# EAGLE design Signal (EAGLE 9.5.2)
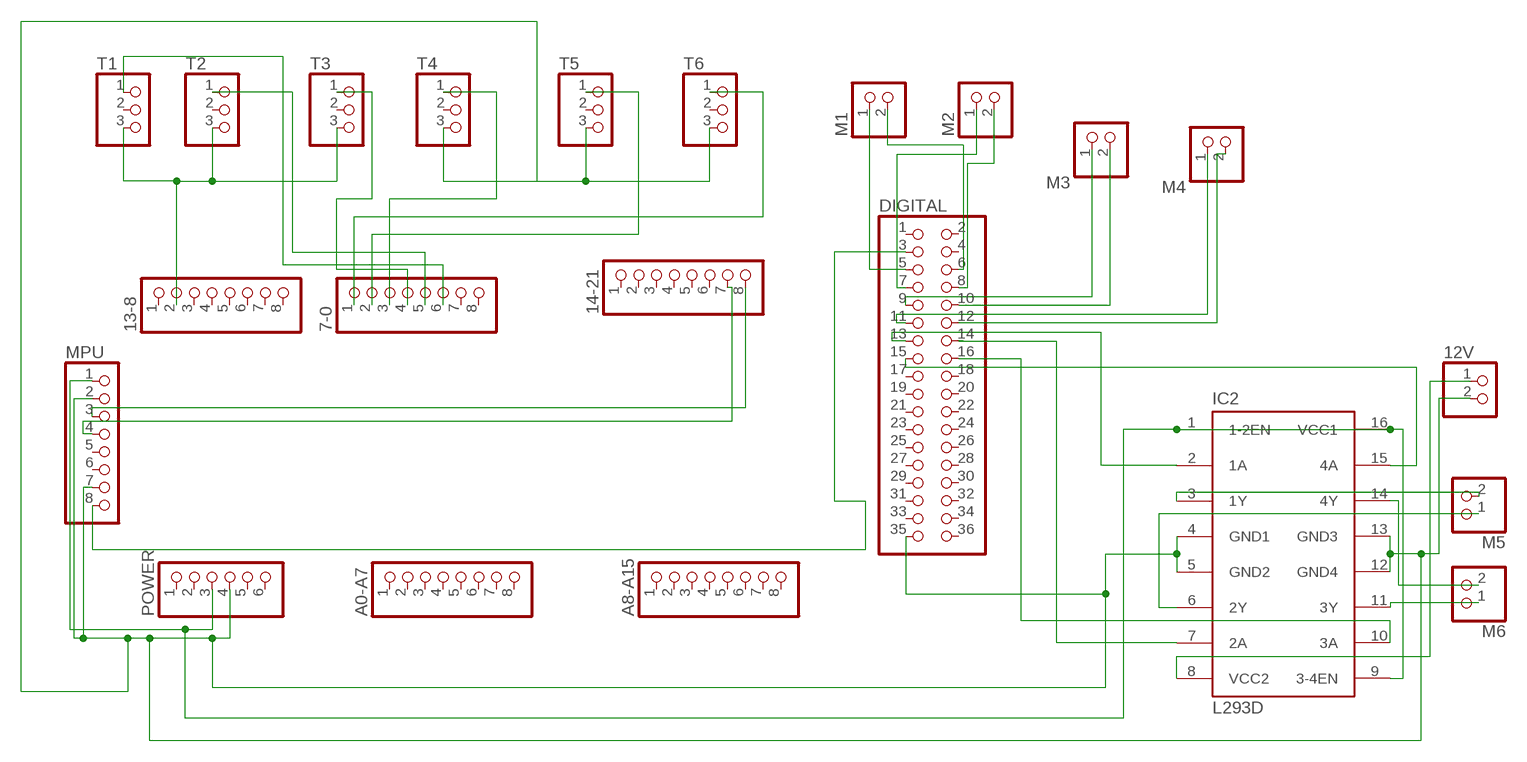
[diagram p0: schematic, sheet 1]

## Parts
7-0  PINHD-1X8  [1X08]
12V  PINHD-1X2  [1X02]
13-8  PINHD-1X8  [1X08]
14-21  PINHD-1X8  [1X08]
A0-A7  PINHD-1X8  [1X08]
A8-A15  PINHD-1X8  [1X08]
DIGITAL  PINHD-2X18  [2X18]
IC2  L293D  [DIL16]
M1  PINHD-1X2  [1X02]
M2  PINHD-1X2  [1X02]
M3  PINHD-1X2  [1X02]
M4  PINHD-1X2  [1X02]
M5  PINHD-1X2  [1X02]
M6  PINHD-1X2  [1X02]
MPU  PINHD-1X8  [1X08]
POWER  PINHD-1X6  [1X06]
T1  PINHD-1X3  [1X03]
T2  PINHD-1X3  [1X03]
T3  PINHD-1X3  [1X03]
T4  PINHD-1X3  [1X03]
T5  PINHD-1X3  [1X03]
T6  PINHD-1X3  [1X03]

## Nets
N$1: DIGITAL.9 M3.1
N$2: DIGITAL.10 M3.2
N$3: DIGITAL.8 M2.2
N$4: 7-0.1 T6.1
N$5: 7-0.2 T5.1
N$6: 7-0.3 T4.1
N$7: 7-0.4 T3.1
N$8: 7-0.5 T2.1
N$10: DIGITAL.5 M1.1
N$11: DIGITAL.6 M1.2
N$12: DIGITAL.7 M2.1
N$13: DIGITAL.11 M4.1
N$14: DIGITAL.12 M4.2
N$15: 12V.2 DIGITAL.35 IC2.4(GND1) IC2.5(GND2) IC2.12(GND4) IC2.13(GND3) MPU.2 MPU.7 POWER.4 T4.3 T5.3 T6.3
N$16: DIGITAL.13 IC2.2(1A)
N$17: DIGITAL.14 IC2.7(2A)
N$18: DIGITAL.15 IC2.15(4A)
N$19: DIGITAL.16 IC2.10(3A)
N$20: IC2.1(1-2EN) IC2.9(3-4EN) IC2.16(VCC1) MPU.1 POWER.3
N$21: DIGITAL.3 MPU.8
N$22: 7-0.6 T1.1
N$23: 14-21.8 MPU.3
N$24: 14-21.7 MPU.4
N$25: 13-8.2 T1.3 T2.3 T3.3
N$31: IC2.6(2Y) M5.1
N$32: 12V.1 IC2.8(VCC2)
N$34: IC2.14(4Y) M6.2
N$35: IC2.3(1Y) M5.2
N$36: IC2.11(3Y) M6.1
Unconnected: 7-0.7 7-0.8 13-8.1 13-8.3 13-8.4 13-8.5 13-8.6 13-8.7 13-8.8 14-21.1 14-21.2 14-21.3 14-21.4 14-21.5 14-21.6 A0-A7.1 A0-A7.2 A0-A7.3 A0-A7.4 A0-A7.5 A0-A7.6 A0-A7.7 A0-A7.8 A8-A15.1 A8-A15.2 A8-A15.3 A8-A15.4 A8-A15.5 A8-A15.6 A8-A15.7 A8-A15.8 DIGITAL.1 DIGITAL.2 DIGITAL.4 DIGITAL.17 DIGITAL.18 DIGITAL.19 DIGITAL.20 DIGITAL.21 DIGITAL.22 DIGITAL.23 DIGITAL.24 DIGITAL.25 DIGITAL.26 DIGITAL.27 DIGITAL.28 DIGITAL.29 DIGITAL.30 DIGITAL.31 DIGITAL.32 DIGITAL.33 DIGITAL.34 DIGITAL.36 MPU.5 MPU.6 POWER.1 POWER.2 POWER.5 POWER.6 T1.2 T2.2 T3.2 T4.2 T5.2 T6.2

## Library data of the parts
7-0 13-8 14-21 A0-A7 A8-A15 MPU = pinhead:PINHD-1X8: PIN HEADER
12V M1-M6 = pinhead:PINHD-1X2: PIN HEADER
DIGITAL = pinhead:PINHD-2X18: PIN HEADER
IC2 = st-microelectronics:L293D: PUSH-PULL 4 CHANNEL DRIVER; MPN: L293D; OC_FARNELL: 9589619; OC_NEWARK: 56P8249
POWER = pinhead:PINHD-1X6: PIN HEADER
T1-T6 = pinhead:PINHD-1X3: PIN HEADER

## Board
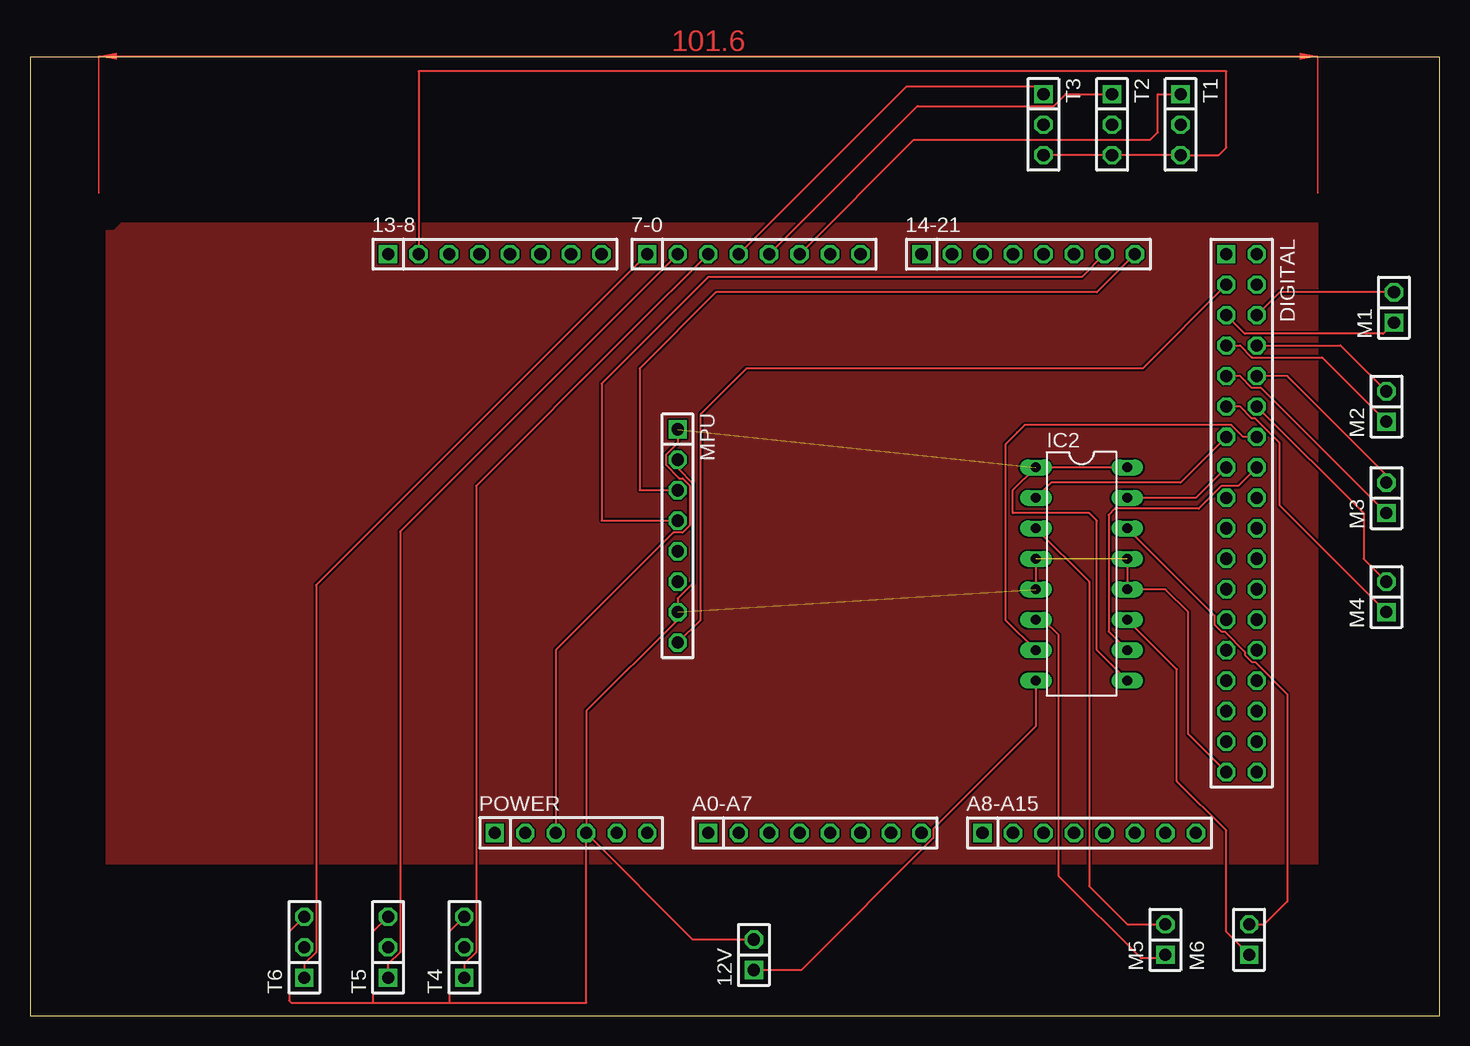
[diagram p1: board, top side]

Size 117.48 x 79.93 mm. Coordinates in mm from the lower left corner, seen from the top.
Outline: 0,0 117.48,0 117.48,79.93 0,79.93 0,0
Copper layers (1*16): Top 0.035mm / dielectric 1.5mm / Bottom 0.035mm
Design rules "default": minimum track width 6mil, minimum drill 0.35mm, track to track 6mil, track to pad 6mil, pad to pad 6mil, via to via 6mil, smd to smd 6mil, copper to edge 40mil, drill to drill 6mil, minimum pad ring 10mil, minimum via ring 8mil, stop-mask expansion 4mil, vias tented up to drill 0mil, thermal gap 10mil

### Footprints (pad centres in the part's own frame; a part is rotated, then mirrored left to right if it is on the bottom)
1X08 = drill 1.016 square: 1 -8.89,0 | drill 1.016 octagon: 2 -6.35,0; 3 -3.81,0; 4 -1.27,0; 5 1.27,0; 6 3.81,0; 7 6.35,0; 8 8.89,0
1X02 = drill 1.016 square: 1 -1.27,0 | drill 1.016 octagon: 2 1.27,0
2X18 = drill 1.016 square: 1 -21.59,-1.27 | drill 1.016 octagon: 2 -21.59,1.27; 3 -19.05,-1.27; 4 -19.05,1.27; 5 -16.51,-1.27; 6 -16.51,1.27; 7 -13.97,-1.27; 8 -13.97,1.27; 9 -11.43,-1.27; 10 -11.43,1.27; 11 -8.89,-1.27; 12 -8.89,1.27; 13 -6.35,-1.27; 14 -6.35,1.27; 15 -3.81,-1.27; 16 -3.81,1.27; 17 -1.27,-1.27; 18 -1.27,1.27; 19 1.27,-1.27; 20 1.27,1.27; 21 3.81,-1.27; 22 3.81,1.27; 23 6.35,-1.27; 24 6.35,1.27; 25 8.89,-1.27; 26 8.89,1.27; 27 11.43,-1.27; 28 11.43,1.27; 29 13.97,-1.27; 30 13.97,1.27; 31 16.51,-1.27; 32 16.51,1.27; 33 19.05,-1.27; 34 19.05,1.27; 35 21.59,-1.27; 36 21.59,1.27
DIL16 = drill 0.813 long: 1 -8.89,-3.81; 2 -6.35,-3.81; 3 -3.81,-3.81; 4 -1.27,-3.81; 5 1.27,-3.81; 6 3.81,-3.81; 7 6.35,-3.81; 8 8.89,-3.81; 9 8.89,3.81; 10 6.35,3.81; 11 3.81,3.81; 12 1.27,3.81; 13 -1.27,3.81; 14 -3.81,3.81; 15 -6.35,3.81; 16 -8.89,3.81
1X06 = drill 1.016 square: 1 -6.35,0 | drill 1.016 octagon: 2 -3.81,0; 3 -1.27,0; 4 1.27,0; 5 3.81,0; 6 6.35,0
1X03 = drill 1.016 square: 1 -2.54,0 | drill 1.016 octagon: 2 0,0; 3 2.54,0

### Placement (x,y rotation side)
7-0  60.33,63.5 0 top
12V  60.33,5.08 90 top
13-8  38.73,63.5 0 top
14-21  83.19,63.5 0 top
A0-A7  65.41,15.24 0 top
A8-A15  88.27,15.24 0 top
DIGITAL  100.97,41.91 270 top
IC2  87.63,36.83 270 top
M1  113.67,59.05 90 top
M2  113.03,50.8 90 top
M3  113.03,43.18 90 top
M4  113.03,34.92 90 top
M5  94.62,6.35 90 top
M6  101.6,6.35 90 top
MPU  53.97,40 270 top
POWER  45.08,15.24 0 top
T1  95.89,74.3 270 top
T2  90.17,74.3 270 top
T3  84.45,74.3 270 top
T4  36.2,5.71 90 top
T5  29.84,5.71 90 top
T6  22.86,5.71 90 top

### Tracks (layer width: path | path; a pad name or v marks a point on that pad's centre or on a via)
N$1
  Top 0.152: M3.1 102.59,52.35 101.83,52.35 100.83,53.34 DIGITAL.9
N$2
  Top 0.152: DIGITAL.10 104.78,53.34 113.03,45.08 M3.2
N$3
  Top 0.152: DIGITAL.8 109.22,55.88 M2.2
N$4
  Top 0.152: T6.1 22.86,4.31 23.85,5.3 23.85,35.92 7-0.1
N$5
  Top 0.152: 7-0.2 30.84,40.36 30.84,5.3 29.84,4.31 T5.1
N$6
  Top 0.152: T4.1 36.2,4.31 37.19,5.3 37.19,44.17 50.17,57.15 7-0.3
N$7
  Top 0.152: 7-0.4 73.03,77.47 83.82,77.47 T3.1
N$8
  Top 0.152: T2.1 86.3,76.84 85.31,75.84 73.94,75.84 7-0.5
N$9
  pour Top: 6.35,65.41 6.35,44.45 6.35,25.4 6.35,12.7 61.59,12.7 107.31,12.7 107.31,66.04 43.18,66.04 8.25,66.04 7.62,66.04 6.98,65.41
N$10
  Top 0.152: M1.1 112.75,56.87 101.24,56.87 DIGITAL.5
N$11
  Top 0.152: M1.2 104.14,60.33 DIGITAL.6
N$12
  Top 0.152: DIGITAL.7 100.83,55.88 101.83,54.89 107.67,54.89 M2.1
N$13
  Top 0.152: M4.1 104.14,42.55 104.14,47.76 102.09,49.81 101.83,49.81 100.83,50.8 DIGITAL.11
N$14
  Top 0.152: DIGITAL.12 111.12,41.91 111.12,38.1 M4.2
N$15  (2 unrouted)
  Top 0.152: IC2.13 IC2.12 94.62,35.56 96.52,33.66 96.52,23.49 DIGITAL.35 | T4.3 34.92,6.98 34.92,1.09 | 34.92,1.09 46.36,1.09 POWER.4 | POWER.4 55.25,6.35 12V.2 | T6.3 21.59,6.98 21.59,1.27 21.77,1.09 28.57,1.09 | 28.57,1.09 34.92,1.09 | T5.3 28.57,6.98 28.57,1.09 | MPU.2 53.97,45.65 55.27,44.35 55.27,36.09 53.97,34.79 MPU.7 53.97,33.02 46.36,25.4 POWER.4 | IC2.4 IC2.5
N$16
  Top 0.152: DIGITAL.13 95.89,44.45 85.09,44.45 IC2.2
N$17
  Top 0.152: DIGITAL.14 101.1,48.26 100.11,49.25 82.89,49.25 82.27,48.63 82.27,48.62 81.28,47.62 81.28,33.02 IC2.7
N$18
  Top 0.152: DIGITAL.15 97.16,43.18 IC2.15
N$19
  Top 0.152: DIGITAL.16 100.69,44.17 99.28,44.17 97.41,42.29 90.41,42.29 89.89,41.77 89.89,32.03 IC2.10
N$20  (1 unrouted)
  Top 0.152: MPU.1 53.97,47.76 52.98,46.77 52.98,45.94 54.12,44.81 54.39,44.81 54.97,44.22 54.97,40.86 54.39,40.28 53.62,40.28 43.81,30.48 POWER.3 | IC2.16 IC2.1 81.92,43.81 81.92,41.91 88.27,41.91 88.9,41.27 88.9,30.48 IC2.9
N$21
  Top 0.152: DIGITAL.3 92.71,53.97 59.69,53.97 55.88,50.17 55.88,33.02 MPU.8
N$22
  Top 0.152: 7-0.6 73.66,73.03 93.34,73.03 93.98,73.66 93.98,76.84 T1.1
N$23
  Top 0.152: 14-21.8 88.9,60.33 57.15,60.33 50.8,53.97 50.8,43.81 MPU.3
N$24
  Top 0.152: 14-21.7 87.63,61.59 56.52,61.59 47.62,52.7 47.62,41.27 MPU.4
N$25
  Top 0.152: T3.3 T2.3 T1.3 99.06,71.75 99.7,72.39 99.7,78.74 32.39,78.74 13-8.2
N$31
  Top 0.152: M5.1 94.31,4.77 92.58,4.77 85.73,11.63 85.73,31.75 84.45,33.02 IC2.6
N$32
  Top 0.152: IC2.8 83.82,24.13 75.29,15.6 75.29,14.83 64.27,3.81 12V.1
N$34
  Top 0.152: M6.2 102.87,7.62 104.78,9.52 104.78,21.59 104.78,21.72 104.78,26.8 102.09,29.49 101.83,29.49 101.24,30.07 101.24,30.33 99.55,32.03 99.28,32.03 98.7,32.61 98.7,33.38 IC2.14
N$35
  Top 0.152: IC2.3 88.27,36.2 88.27,10.79 91.44,7.62 M5.2
N$36
  Top 0.152: M6.1 99.7,6.98 99.7,15.44 95.58,19.56 95.58,28.88 IC2.11
(copper drawn outside any net)
  shapes: Top area x2